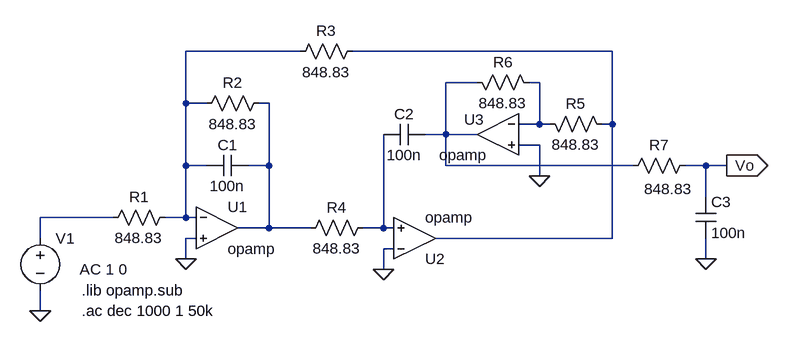
[diagram p0: schematic TS3_Albanesi_SimulacionPunto5.asc]
TS3_Albanesi_SimulacionPunto5.asc, the LTspice schematic file:
Version 4
SHEET 1 968 680
WIRE 224 -160 48 -160
WIRE 704 -160 304 -160
WIRE 496 -112 448 -112
WIRE 592 -112 576 -112
WIRE 48 -80 48 -160
WIRE 80 -80 48 -80
WIRE 176 -80 160 -80
WIRE 592 -48 592 -112
WIRE 592 -48 560 -48
WIRE 608 -48 592 -48
WIRE 704 -48 704 -160
WIRE 704 -48 688 -48
WIRE 448 -32 448 -112
WIRE 448 -32 416 -32
WIRE 496 -32 448 -32
WIRE 592 -16 560 -16
WIRE 48 16 48 -80
WIRE 80 16 48 16
WIRE 176 16 176 -80
WIRE 176 16 144 16
WIRE 448 16 448 -32
WIRE 736 16 448 16
WIRE 848 16 816 16
WIRE 880 16 848 16
WIRE 592 32 592 -16
WIRE 848 64 848 16
WIRE -64 96 -176 96
WIRE 48 96 48 16
WIRE 48 96 16 96
WIRE 64 96 48 96
WIRE 176 112 176 16
WIRE 176 112 128 112
WIRE 240 112 176 112
WIRE 352 112 352 -32
WIRE 352 112 320 112
WIRE 368 112 352 112
WIRE -176 128 -176 96
WIRE 64 128 48 128
WIRE 704 128 704 -48
WIRE 704 128 432 128
WIRE 368 144 352 144
WIRE 48 160 48 128
WIRE 848 160 848 128
WIRE 352 176 352 144
WIRE -176 240 -176 208
FLAG -176 240 0
FLAG 592 32 0
FLAG 352 176 0
FLAG 48 160 0
FLAG 848 160 0
FLAG 880 16 Vo
IOPIN 880 16 Out
SYMBOL voltage -176 112 R0
WINDOW 123 61 64 Left 2
WINDOW 39 0 0 Left 0
SYMATTR Value2 AC 1 0
SYMATTR InstName V1
SYMATTR Value ""
SYMBOL OpAmps\\opamp 96 48 R0
SYMATTR InstName U1
SYMBOL res 32 80 R90
WINDOW 0 0 56 VBottom 2
WINDOW 3 32 56 VTop 2
SYMATTR InstName R1
SYMATTR Value 848.83
SYMBOL res 176 -96 R90
WINDOW 0 0 56 VBottom 2
WINDOW 3 32 56 VTop 2
SYMATTR InstName R2
SYMATTR Value 848.83
SYMBOL res 320 -176 R90
WINDOW 0 0 56 VBottom 2
WINDOW 3 32 56 VTop 2
SYMATTR InstName R3
SYMATTR Value 848.83
SYMBOL res 336 96 R90
WINDOW 0 0 56 VBottom 2
WINDOW 3 32 56 VTop 2
SYMATTR InstName R4
SYMATTR Value 848.83
SYMBOL cap 144 0 R90
WINDOW 0 0 32 VBottom 2
WINDOW 3 32 32 VTop 2
SYMATTR InstName C1
SYMATTR Value 100n
SYMBOL OpAmps\\opamp 400 192 M180
SYMATTR InstName U2
SYMBOL cap 416 -48 R90
WINDOW 0 0 32 VBottom 2
WINDOW 3 32 32 VTop 2
SYMATTR InstName C2
SYMATTR Value 100n
SYMBOL OpAmps\\opamp 528 -96 M0
WINDOW 0 21 41 Left 2
SYMATTR InstName U3
SYMBOL res 592 -64 M90
WINDOW 0 0 56 VBottom 2
WINDOW 3 32 56 VTop 2
SYMATTR InstName R5
SYMATTR Value 848.83
SYMBOL res 480 -128 M90
WINDOW 0 0 56 VBottom 2
WINDOW 3 32 56 VTop 2
SYMATTR InstName R6
SYMATTR Value 848.83
SYMBOL res 832 0 R90
WINDOW 0 0 56 VBottom 2
WINDOW 3 36 42 VTop 2
SYMATTR InstName R7
SYMATTR Value 848.83
SYMBOL cap 832 64 R0
SYMATTR InstName C3
SYMATTR Value 100n
TEXT -112 208 Left 2 !.lib opamp.sub
TEXT -112 240 Left 2 !.ac dec 1000 1 50k

The netlist it stands for:
* TS3_Albanesi_SimulacionPunto5.asc
V1 N006 0 AC 1 0
XU1 N001 0 N005 opamp Aol=100K GBW=10Meg  ; pins invin noninvin out
R1 N001 N006 848.83
R2 N005 N001 848.83
R3 N002 N001 848.83
R4 N007 N005 848.83
C1 N005 N001 100n
XU2 0 N007 N002 opamp Aol=100K GBW=10Meg  ; pins invin noninvin out
C2 N003 N007 100n
XU3 N004 0 N003 opamp Aol=100K GBW=10Meg  ; pins invin noninvin out
R5 N004 N002 848.83
R6 N003 N004 848.83
R7 Vo N003 848.83
C3 Vo 0 100n
.lib opamp.sub
.ac dec 1000 1 50k
.backanno
.end